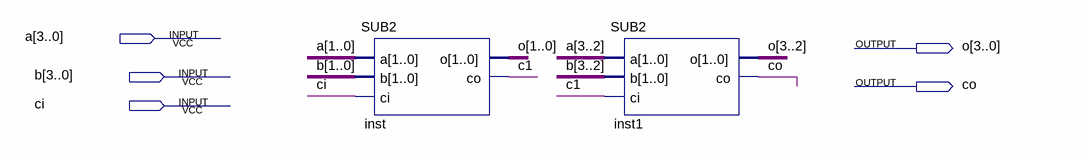
[diagram p0: schematic sheet]
// Quartus schematic SUB4.bdf as structural Verilog: 2 symbols, 5 pins
module SUB4 (
  input  [3:0] a,
  input  [3:0] b,
  input  ci,
  output [3:0] o,
  output co
);

  wire c1;

  SUB2 inst (.a(a[1:0]), .b(b[1:0]), .ci(ci), .o(o[1:0]), .co(c1));
  SUB2 inst1 (.a(a[3:2]), .b(b[3:2]), .ci(c1), .o(o[3:2]), .co(co));
endmodule
